# Altium schematic sheet Sensor Panel.SchDoc
size A3
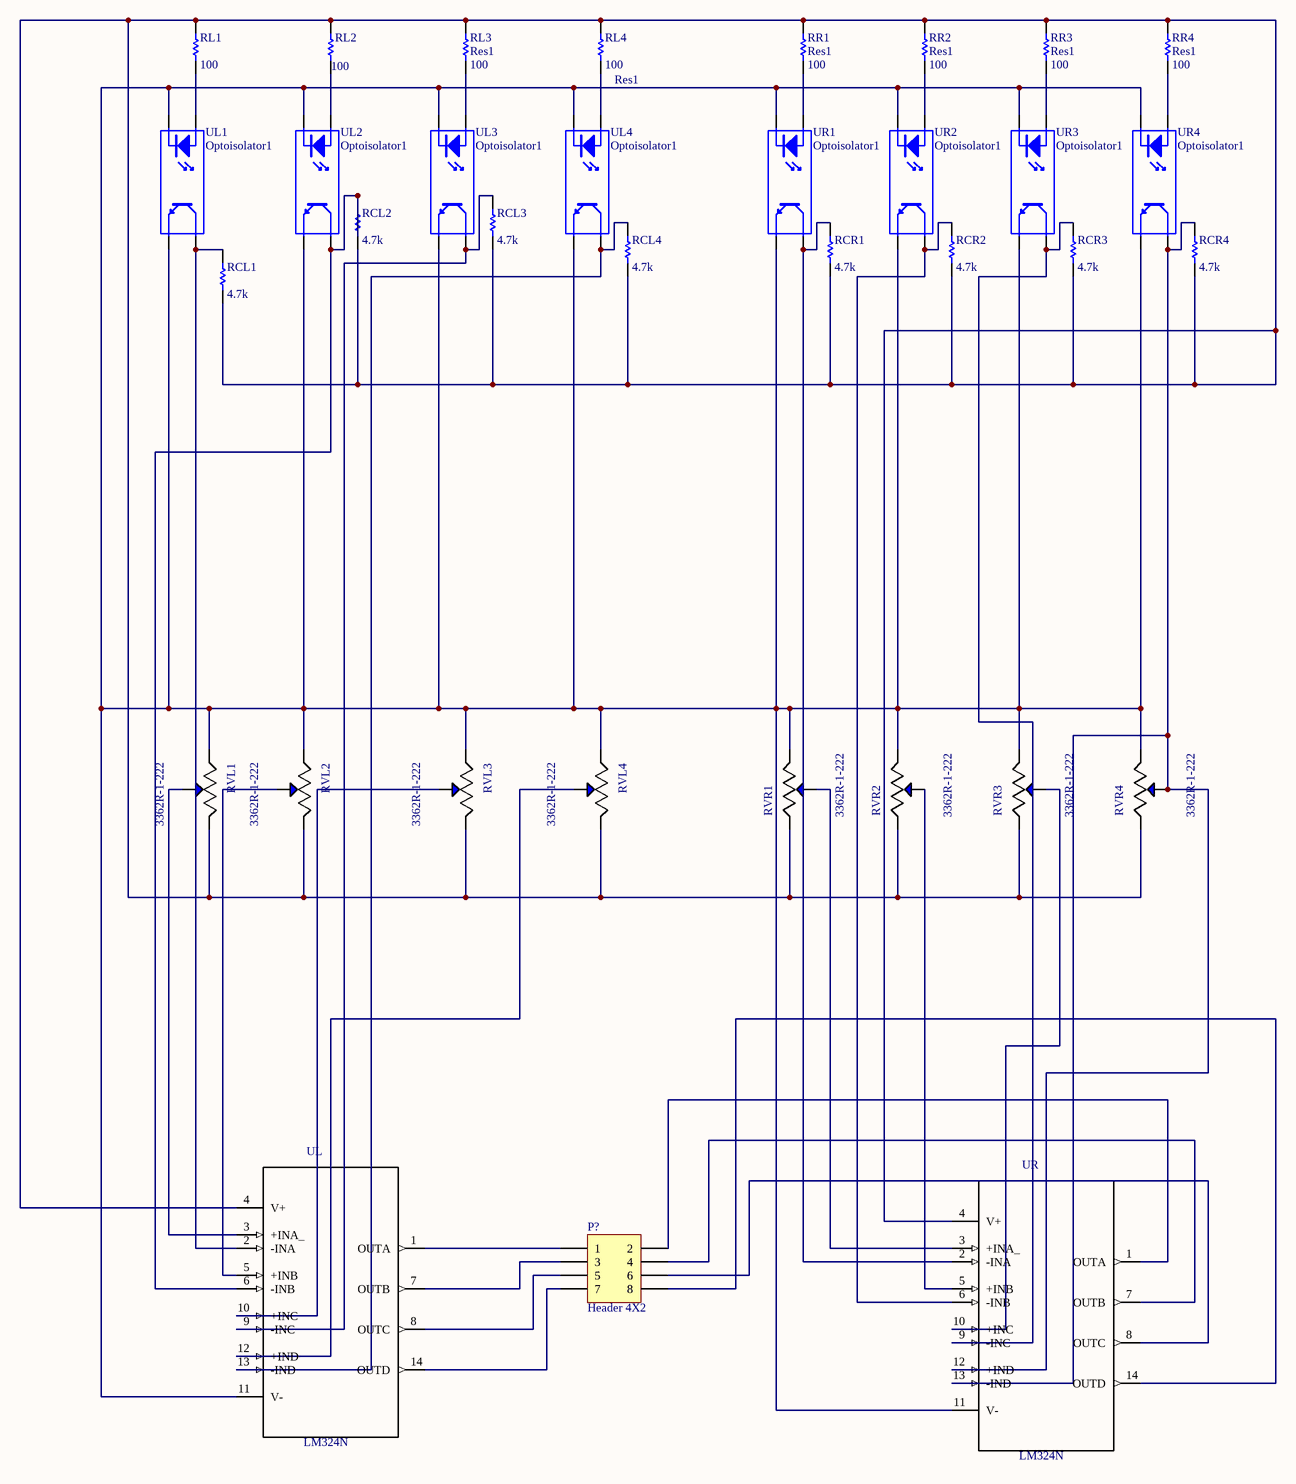
[diagram p0: Sensor Panel.SchDoc]

## Parts
P?  Header 4X2  [HDR2X4]
RCL1  value 4.7k  [AXIAL-0.3]
RCL2  value 4.7k  [AXIAL-0.3]
RCL3  value 4.7k  [AXIAL-0.3]
RCL4  value 4.7k  [AXIAL-0.3]
RCR1  value 4.7k  [AXIAL-0.3]
RCR2  value 4.7k  [AXIAL-0.3]
RCR3  value 4.7k  [AXIAL-0.3]
RCR4  value 4.7k  [AXIAL-0.3]
RL1  value 100  [AXIAL-0.3]
RL2  value 100  [AXIAL-0.3]
RL3  Res1  value 100  [AXIAL-0.3]
RL4  Res1  value 100  [AXIAL-0.3]
RR1  Res1  value 100  [AXIAL-0.3]
RR2  Res1  value 100  [AXIAL-0.3]
RR3  Res1  value 100  [AXIAL-0.3]
RR4  Res1  value 100  [AXIAL-0.3]
RVL1  3362R-1-222  [*TRIM_3362R-1-222]
RVL2  3362R-1-222  [*TRIM_3362R-1-222]
RVL3  3362R-1-222  [*TRIM_3362R-1-222]
RVL4  3362R-1-222  [*TRIM_3362R-1-222]
RVR1  3362R-1-222  [*TRIM_3362R-1-222]
RVR2  3362R-1-222  [*TRIM_3362R-1-222]
RVR3  3362R-1-222  [*TRIM_3362R-1-222]
RVR4  3362R-1-222  [*TRIM_3362R-1-222]
UL  LM324N  [*DIP254P762X508-14]
UL1  Optoisolator1  [DIP-4]
UL2  Optoisolator1  [DIP-4]
UL3  Optoisolator1  [DIP-4]
UL4  Optoisolator1  [DIP-4]
UR  LM324N  [*DIP254P762X508-14]
UR1  Optoisolator1  [DIP-4]
UR2  Optoisolator1  [DIP-4]
UR3  Optoisolator1  [DIP-4]
UR4  Optoisolator1  [DIP-4]

## Nets
NetP?_1: P?.1 UL.1(OUTA)
NetP?_2: P?.2 UR.1(OUTA)
NetP?_3: P?.3 UL.7(OUTB)
NetP?_4: P?.4 UR.7(OUTB)
NetP?_5: P?.5 UL.8(OUTC)
NetP?_6: P?.6 UR.8(OUTC)
NetP?_7: P?.7 UL.14(OUTD)
NetP?_8: P?.8 UR.14(OUTD)
NetRCL1_1: RCL1.1 RCL2.1 RCL3.1 RCL4.1 RCR1.1 RCR2.1 RCR3.1 RCR4.1 RL1.2 RL2.2 RL3.2 RL4.2 RR1.2 RR2.2 RR3.2 RR4.2 RVL1.3(CW) RVL2.3(CW) RVL3.3(CW) RVL4.3(CW) RVR1.1(CCW) RVR2.1(CCW) RVR3.1(CCW) RVR4.1(CCW) UL.4(V+) UR.4(V+)
NetRCL1_2: RCL1.2 UL.2(-INA) UL1.4(C)
NetRCL2_2: RCL2.2 UL.6(-INB) UL2.4(C)
NetRCL3_2: RCL3.2 UL.9(-INC) UL3.4(C)
NetRCL4_2: RCL4.2 UL.13(-IND) UL4.4(C)
NetRCR1_2: RCR1.2 UR.2(-INA) UR1.4(C)
NetRCR2_2: RCR2.2 UR.6(-INB) UR2.4(C)
NetRCR3_2: RCR3.2 UR.9(-INC) UR3.4(C)
NetRCR4_2: RCR4.2 RVR4.2(WIPER) UR.12(+IND) UR.13(-IND) UR4.4(C)
NetRL1_1: RL1.1 UL1.1(A)
NetRL2_1: RL2.1 UL2.1(A)
NetRL3_1: RL3.1 UL3.1(A)
NetRL4_1: RL4.1 UL4.1(A)
NetRR1_1: RR1.1 UR1.1(A)
NetRR2_1: RR2.1 UR2.1(A)
NetRR3_1: RR3.1 UR3.1(A)
NetRR4_1: RR4.1 UR4.1(A)
NetRVL1_1: RVL1.1(CCW) RVL2.1(CCW) RVL3.1(CCW) RVL4.1(CCW) RVR1.3(CW) RVR2.3(CW) RVR3.3(CW) RVR4.3(CW) UL.11(V-) UL1.2(K) UL1.3(E) UL2.2(K) UL2.3(E) UL3.2(K) UL3.3(E) UL4.2(K) UL4.3(E) UR.11(V-) UR1.2(K) UR1.3(E) UR2.2(K) UR2.3(E) UR3.2(K) UR3.3(E) UR4.2(K) UR4.3(E)
NetRVL1_2: RVL1.2(WIPER) UL.3(+INA_)
NetRVL2_2: RVL2.2(WIPER) UL.5(+INB)
NetRVL3_2: RVL3.2(WIPER) UL.10(+INC)
NetRVL4_2: RVL4.2(WIPER) UL.12(+IND)
NetRVR1_2: RVR1.2(WIPER) UR.3(+INA_)
NetRVR2_2: RVR2.2(WIPER) UR.5(+INB)
NetRVR3_2: RVR3.2(WIPER) UR.10(+INC)

## Library data of the parts
P? = Header 4X2: Header, 4-Pin, Dual row; LatestRevisionDate: 17-Jul-2002; LatestRevisionNote: Re-released for DXP Platform.; Publisher: Altium Limited
RCL1-RCL4 RCR1-RCR4 RL1-RL4 RR1-RR4 = Res1: Resistor; Published: 8-Jun-2000; LatestRevisionDate: 17-Jul-2002; LatestRevisionNote: Re-released for DXP Platform.; PackageReference: AXIAL-0.3; Publisher: Altium Limited; PackageDescription: Axial Device, Thru-Hole; 2 Leads; 0.3 in Pin Spacing
RVL1-RVL4 RVR1-RVR4 = 3362R-1-222: Trimpot 2.2k Ohm 1/4 Sq Cer St; MF: Bourns; SnapEDA_Link: https://www.snapeda.com/parts/3362R-1-222/Bourns/view-part/?ref=snap; Package: 2220 Bourns; Availability: Unavailable; Price: None; MP: 3362R-1-222; Value: *
UL UR = LM324N: OP Amp Quad GP ?15V/30V 14-Pin PDIP Tube; MF: ON Semiconductor; Package: DIP-14 STMicroelectronics; SnapEDA_Link: https://www.snapeda.com/parts/LM324N/ON%20Semiconductor/view-part/?ref=snap; Price: None; Availability: Unavailable; MP: LM324N; Value: *
UL1-UL4 UR1-UR4 = Optoisolator1: 4-Pin Phototransistor Optocoupler; Published: 24-Mar-1999; LatestRevisionDate: 04-Mar-2005; LatestRevisionNote: Sch pins 3 & 4 Swapped.; DatasheetVersion: Nov-2003; PackageReference: DIP-4; Publisher: Altium Limited